# EAGLE design MRDT0002A1 (EAGLE 6.2)

## Sheet 1 of 2
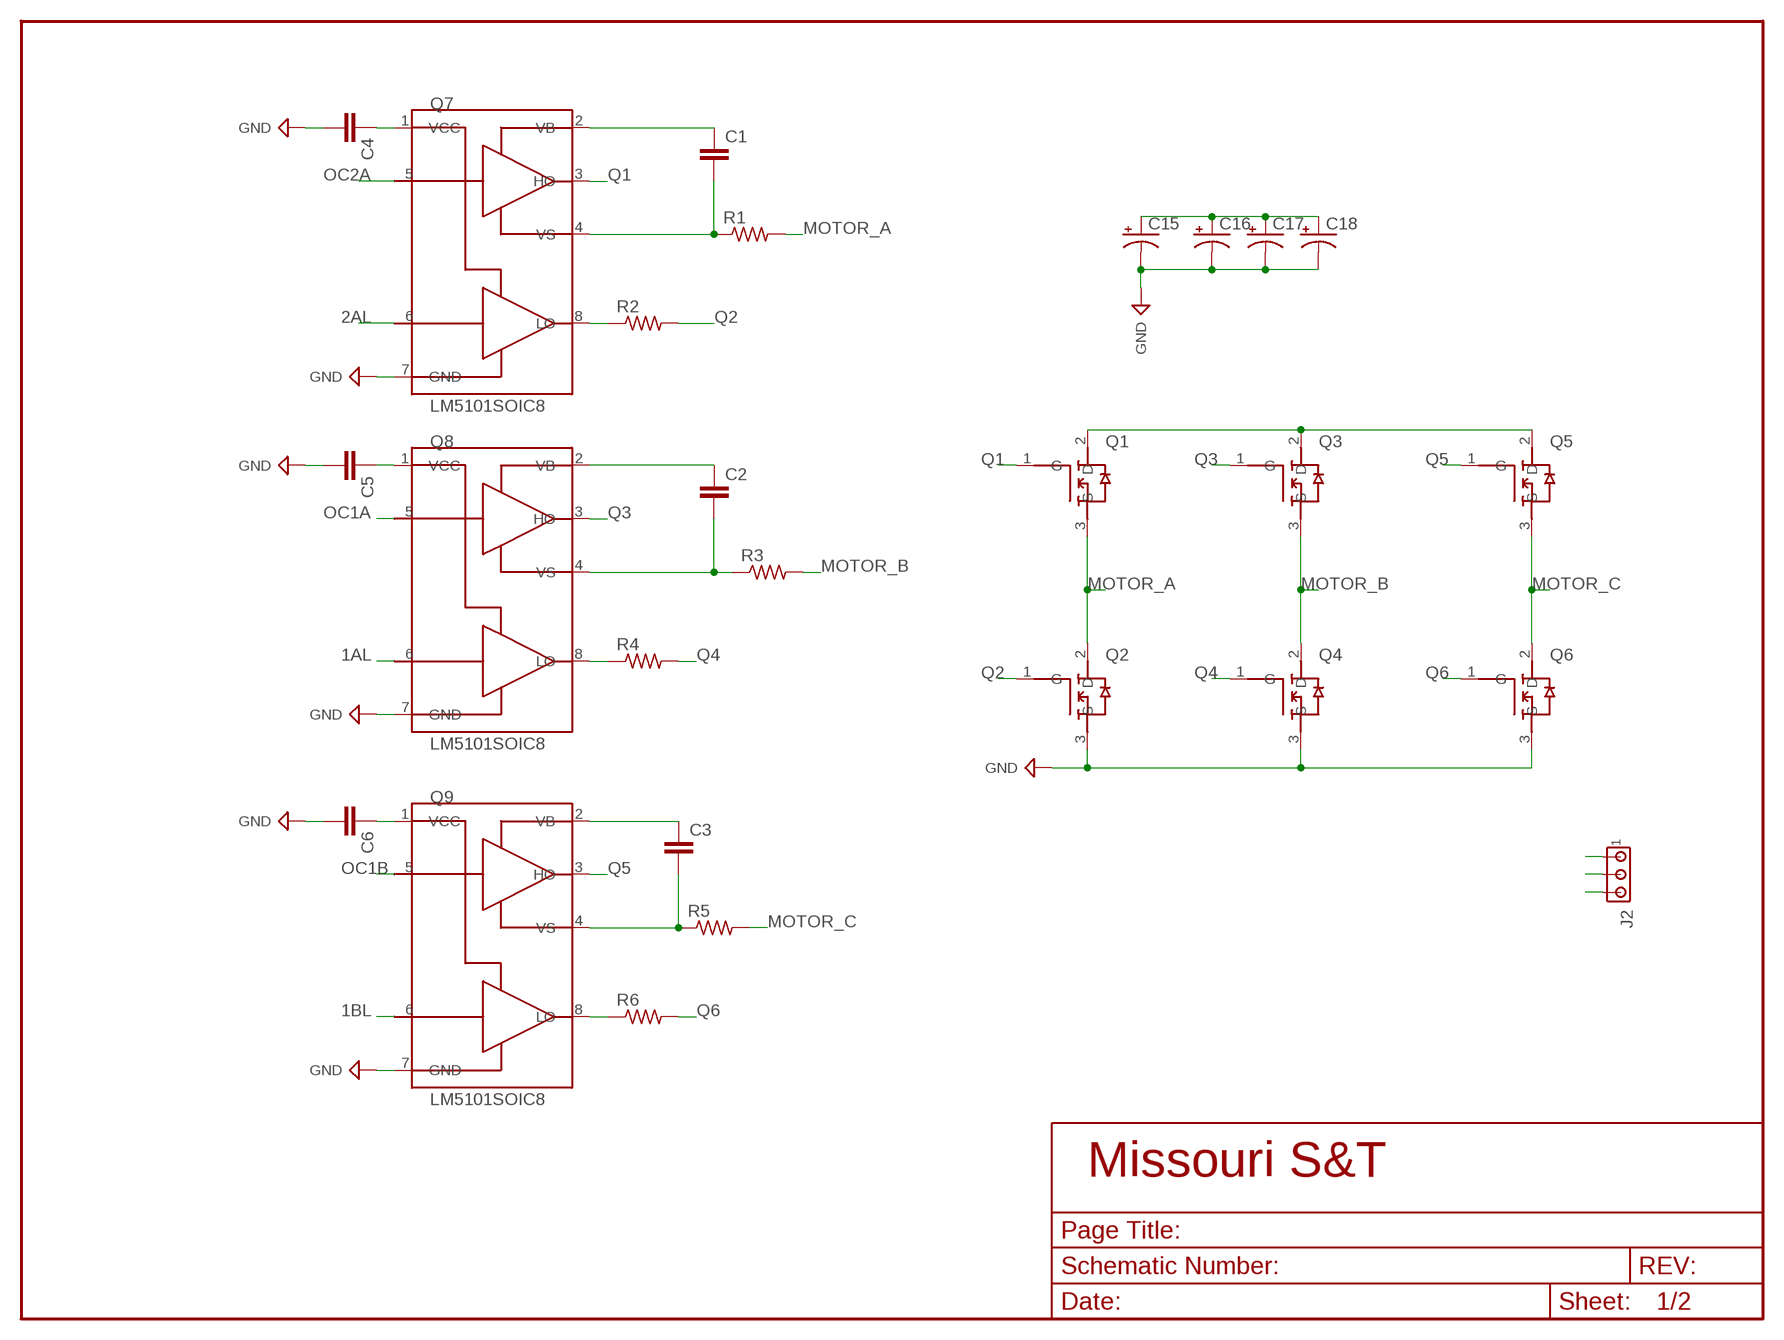
[diagram p0: schematic, sheet 1]

### Parts
C1  C_CAP_1206  [C_1206]
C2  C_CAP_1206  [C_1206]
C3  C_CAP_1206  [C_1206]
C4  C_CAP_1206  [C_1206]
C5  C_CAP_1206  [C_1206]
C6  C_CAP_1206  [C_1206]
C15  CAP_POL10MMSM  [C_10MMSM]
C16  CAP_POL10MMSM  [C_10MMSM]
C17  CAP_POL10MMSM  [C_10MMSM]
C18  CAP_POL10MMSM  [C_10MMSM]
J2  J_MTA3P_156  [J_MTA156_3P]
Q1  N-CH-MOSFETTO252  [TO-252]
Q2  N-CH-MOSFETTO252  [TO-252]
Q3  N-CH-MOSFETTO252  [TO-252]
Q4  N-CH-MOSFETTO252  [TO-252]
Q5  N-CH-MOSFETTO252  [TO-252]
Q6  N-CH-MOSFETTO252  [TO-252]
Q7  LM5101SOIC8  [SOIC8]
Q8  LM5101SOIC8  [SOIC8]
Q9  LM5101SOIC8  [SOIC8]
R1  R_RES_0805  [R_0805]
R2  R_RES_0805  [R_0805]
R3  R_RES_0805  [R_0805]
R4  R_RES_0805  [R_0805]
R5  R_RES_0805  [R_0805]
R6  R_RES_0805  [R_0805]

### Nets
1AL: Q8.6(LI) ; also sheet 2
1BL: Q9.6(LI) ; also sheet 2
2AL: Q7.6(LI) ; also sheet 2
+12V: C4.1 C5.1 C6.1 Q7.1(VCC) Q8.1(VCC) Q9.1(VCC) ; also sheet 2
+24V: C15.+ C16.+ C17.+ C18.+ Q1.2(D) Q3.2(D) Q5.2(D)
GND: C4.2 C5.2 C6.2 C15.- C16.- C17.- C18.- Q2.3(S) Q4.3(S) Q6.3(S) Q7.7(GND) Q8.7(GND) Q9.7(GND) ; supply symbol labelled SUP_GND ; also sheet 2
MOTOR_A: J2.3 Q1.3(S) Q2.2(D) R1.2
MOTOR_B: J2.2 Q3.3(S) Q4.2(D) R3.2
MOTOR_C: J2.1 Q5.3(S) Q6.2(D) R5.2
N$1: C2.1 Q8.2(VB)
N$2: C2.2 Q8.4(VS) R3.1
N$3: C3.1 Q9.2(VB)
N$4: C3.2 Q9.4(VS) R5.1
N$5: C1.1 Q7.2(VB)
N$6: C1.2 Q7.4(VS) R1.1
N$11: Q8.8(LO) R4.1
N$14: Q7.8(LO) R2.1
N$16: Q9.8(LO) R6.1
OC1A: Q8.5(HI) ; also sheet 2
OC1B: Q9.5(HI) ; also sheet 2
OC2A: Q7.5(HI) ; also sheet 2
Q1: Q1.1(G) Q7.3(HO)
Q2: Q2.1(G) R2.2
Q3: Q3.1(G) Q8.3(HO)
Q4: Q4.1(G) R4.2
Q5: Q5.1(G) Q9.3(HO)
Q6: Q6.1(G) R6.2

## Sheet 2 of 2
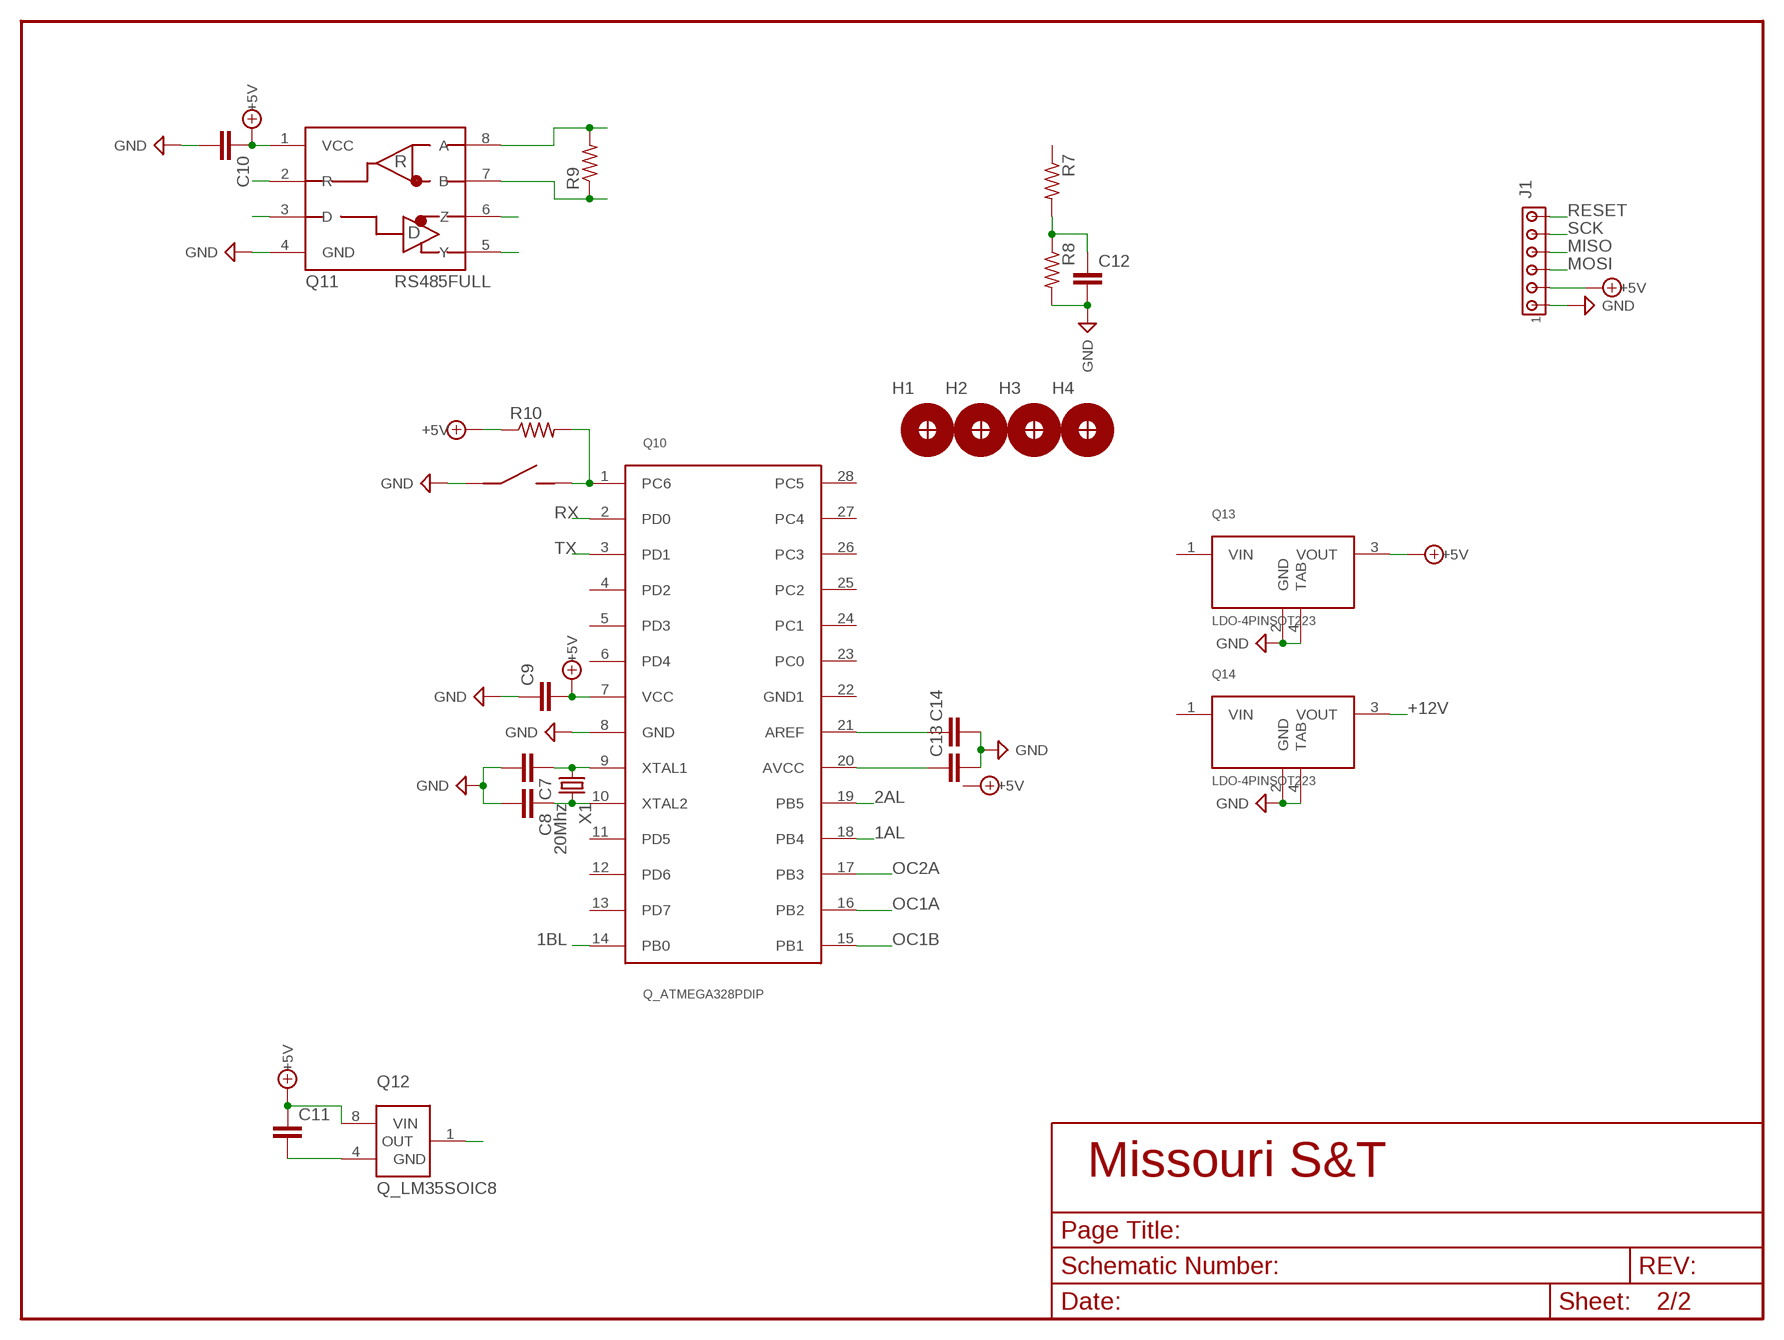
[diagram p1: schematic, sheet 2]

### Parts
C7  C_CAP_1206  [C_1206]
C8  C_CAP_1206  [C_1206]
C9  C_CAP_0805  [C_0805]
C10  C_CAP_0805  [C_0805]
C11  C_CAP_0805  [C_0805]
C12  C_CAP_0805  [C_0805]
C13  C_CAP_0805  [C_0805]
C14  C_CAP_0805  [C_0805]
H1  H_MNTHOLE_#4  [H_MNTHOLE_#4]
H2  H_MNTHOLE_#4  [H_MNTHOLE_#4]
H3  H_MNTHOLE_#4  [H_MNTHOLE_#4]
H4  H_MNTHOLE_#4  [H_MNTHOLE_#4]
J1  J_MTA6P_100  [J_MTA100_6P]
J3  J_MC32857  [J_TOGGLE]
Q10  Q_ATMEGA328PDIP  [DIP28]
Q11  RS485FULL  [SOIC8]
Q12  Q_LM35SOIC8  [SOIC8]
Q13  LDO-4PINSOT223  [SOT-223]
Q14  LDO-4PINSOT223  [SOT-223]
R7  R_RES_0805  [R_0805]
R8  R_RES_0805  [R_0805]
R9  R_RES_0805  [R_0805]
R10  R_RES_0805  [R_0805]
X1  20Mhz  X_HC49SCRYSTALTH  [HC-49]

### Nets
1AL: Q10.18(PB4) ; also sheet 1
1BL: Q10.14(PB0) ; also sheet 1
2AL: Q10.19(PB5) ; also sheet 1
+5V: C9.2 C10.1 C11.1 J1.2 Q10.7(VCC) Q11.1(VCC) Q12.8(VIN) Q13.3(VOUT) R10.1 ; supply symbol labelled SUP_+5V
+12V: Q14.3(VOUT) ; also sheet 1
GND: C7.2 C8.2 C9.1 C10.2 C12.2 C13.2 C14.2 J1.1 J3.P$1 Q10.8(GND) Q11.4(GND) Q13.2(GND) Q13.4(TAB) Q14.2(GND) Q14.4(TAB) R8.2 ; supply symbol labelled SUP_GND ; also sheet 1
MISO: J1.4
MOSI: J1.3
N$7: J3.P$2 Q10.1(PC6) R10.2
N$12: C13.1 Q10.20(AVCC)
N$15: C14.1 Q10.21(AREF)
N$17: C11.2 Q12.4(GND)
N$20: Q12.1(OUT)
N$21: C12.1 R7.2 R8.1
N$22: Q11.7(B) R9.1
N$23: Q11.8(A) R9.2
N$24: Q11.6(Z)
N$25: Q11.5(Y)
N$28: C7.1 Q10.9(XTAL1) X1.P$1
N$29: C8.1 Q10.10(XTAL2) X1.P$2
OC1A: Q10.16(PB2) ; also sheet 1
OC1B: Q10.15(PB1) ; also sheet 1
OC2A: Q10.17(PB3) ; also sheet 1
RESET: J1.6
RX: Q10.2(PD0) Q11.2(R)
SCK: J1.5
TX: Q10.3(PD1) Q11.3(D)
Unconnected: H1.1 H2.1 H3.1 H4.1 Q10.4(PD2) Q10.5(PD3) Q10.6(PD4) Q10.11(PD5) Q10.12(PD6) Q10.13(PD7) Q10.22(GND1) Q10.23(PC0) Q10.24(PC1) Q10.25(PC2) Q10.26(PC3) Q10.27(PC4) Q10.28(PC5) Q13.1(VIN) Q14.1(VIN) R7.1

## Library data of the parts
C1-C14 = Master:C_CAP
C15-C18 = Master:CAP_POL: Generic Polarized Capacitor
H1-H4 = Lib_TH:H_MNTHOLE
J1 = Lib_TH:J_MTA6P
J2 = Lib_TH:J_MTA3P
J3 = Master:J_MC32857: SWITCH, TACTILE, SPST-NO, 50mA, THD
Q1-Q6 = Master:N-CH-MOSFET: Generic N-CH MOSFET
Q7-Q9 = Master:LM5101: IC DVR HALF-BRIDGE HV 8-SOIC 120V 3A/2A/1A for A/B/C respectively
Q10 = Master:Q_ATMEGA328P: ATMEGA 328P
Q11 = Master:RS485FULL: Generic Full-Duplex RS485 Transciever, compatible with ADM485x series and MAX308x
Q12 = Master:Q_LM35: IC, TEMPERATURE SENSOR, 0.4°C, TO-92-3
Q13 Q14 = Master:LDO-4PIN: Standard 4pin LDO
R1-R9 = Master:R_RES
R10 = Lib_Passive:R_RES
X1 = Master:X_HC49SCRYSTAL: CRYSTAL METAL CAN, 16MHZ, 18PF, HC-49/US

## Board
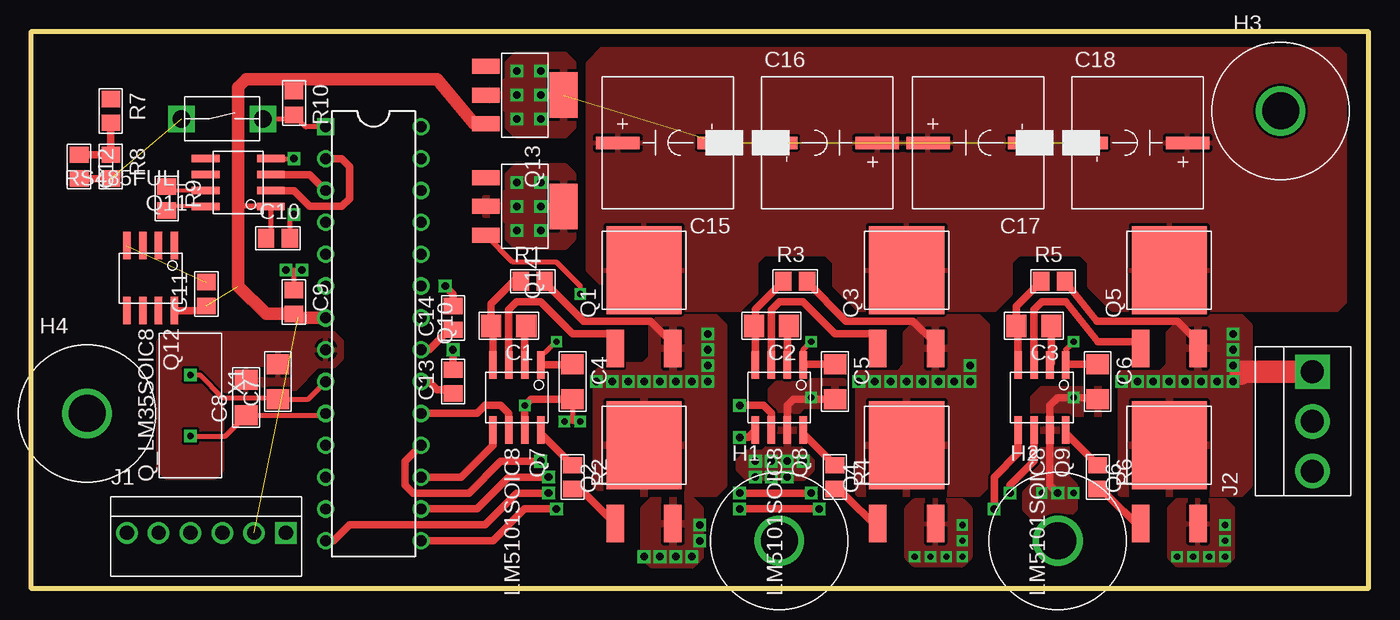
[diagram p2: board, top side]
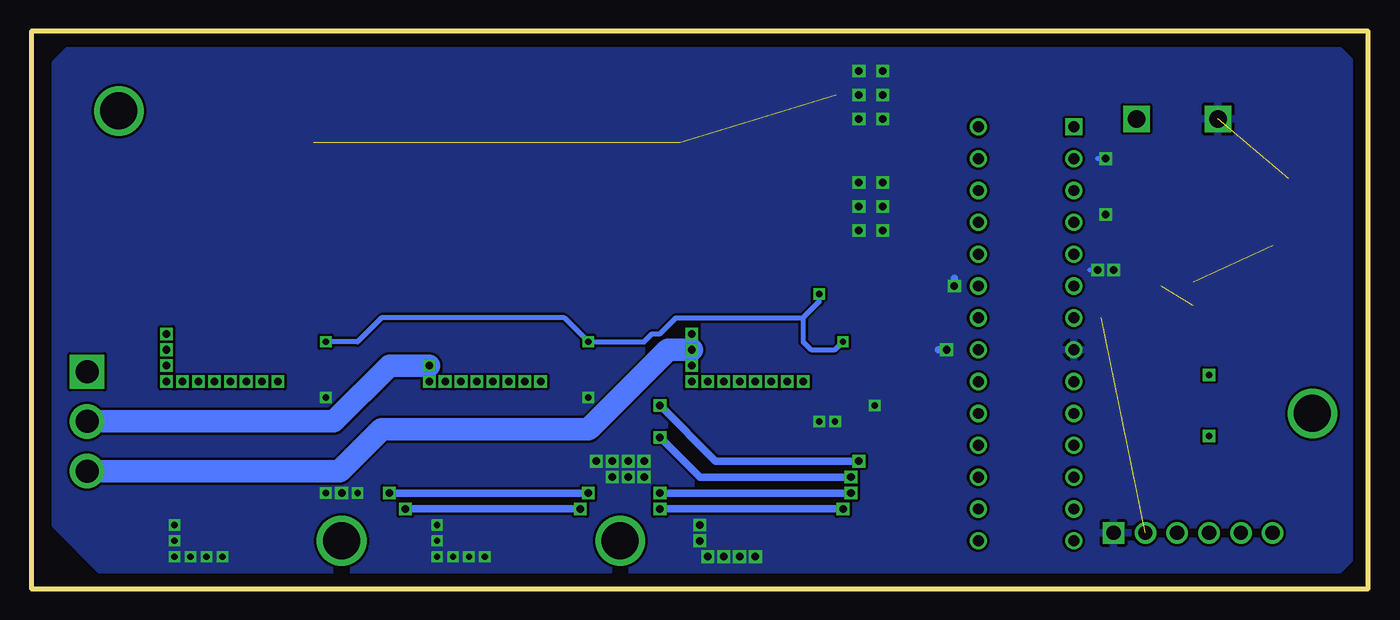
[diagram p3: board, bottom side, seen from below]

Size 106.68 x 44.45 mm. Coordinates in mm from the lower left corner, seen from the top.
Outline: 0,0 0,44.45 106.68,44.45 106.68,0 0,0
Copper layers (1*16): Top 0.035mm / dielectric 1.5mm / Bottom 0.035mm
Design rules: minimum track width 10mil, minimum drill 15mil, track to track 8mil, track to pad 8mil, pad to pad 8mil, via to via 8mil, smd to smd 8mil, copper to edge 40mil, drill to drill 8mil, minimum pad ring 10mil, minimum via ring 8mil, stop-mask expansion 4mil, vias tented up to drill 0mil, thermal gap 10mil

### Footprints (pad centres in the part's own frame; a part is rotated, then mirrored left to right if it is on the bottom)
C_1206 = smd 1.6 x 1.8: 1 -1.4,0; 2 1.4,0
C_0805 = smd 1.3 x 1.5: 1 -0.95,0; 2 0.95,0
C_10MMSM = smd 1 x 3.5: + 0,4; - 0,-4.1
H_MNTHOLE_#4 = drill 2.946: 1 0,0
J_MTA100_6P = drill 1.143 square: 1 6.35,0 | drill 1.143: 2 3.81,0; 3 1.27,0; 4 -1.27,0; 5 -3.81,0; 6 -6.35,0
J_MTA156_3P = drill 1.829 square: 1 3.962,0 | drill 1.829: 2 0,0; 3 -3.962,0
J_TOGGLE = drill 1.4 square: P$1 -3.25,0; P$2 3.25,0
TO-252 = smd 1.4 x 3: 1 -2.3,-6.25; 3 2.3,-6.25 | smd 6 x 7: 2 0,0
SOIC8 = smd 2.2 x 0.6: 1 -2.6,1.905; 2 -2.6,0.635; 3 -2.6,-0.635; 4 -2.6,-1.905; 5 2.6,-1.905; 6 2.6,-0.635; 7 2.6,0.635; 8 2.6,1.905
DIP28 = drill 0.864 square: 1 -16.51,-3.81 | drill 0.864: 2 -13.97,-3.81; 3 -11.43,-3.81; 4 -8.89,-3.81; 5 -6.35,-3.81; 6 -3.81,-3.81; 7 -1.27,-3.81; 8 1.27,-3.81; 9 3.81,-3.81; 10 6.35,-3.81; 11 8.89,-3.81; 12 11.43,-3.81; 13 13.97,-3.81; 14 16.51,-3.81; 15 16.51,3.81; 16 13.97,3.81; 17 11.43,3.81; 18 8.89,3.81; 19 6.35,3.81; 20 3.81,3.81; 21 1.27,3.81; 22 -1.27,3.81; 23 -3.81,3.81; 24 -6.35,3.81; 25 -8.89,3.81; 26 -11.43,3.81; 27 -13.97,3.81; 28 -16.51,3.81
SOT-223 = smd 1.2 x 2.2: 1 -2.3,-3.1; 2 0,-3.1; 3 2.3,-3.1 | smd 3.6 x 2.2: 4 0,3.1
R_0805 = smd 1.3 x 1.5: 1 -0.95,0; 2 0.95,0
HC-49 = drill 0.5 square: P$1 -2.44,0; P$2 2.44,0

### Placement (x,y rotation side)
C1  38.1,20.95 180 top
C2  59.05,20.95 180 top
C3  80.01,20.95 180 top
C4  43.18,16.51 270 top
C5  64.14,16.51 270 top
C6  85.09,16.51 270 top
C7  19.68,16.51 90 top
C8  17.14,15.24 90 top
C9  20.95,22.86 270 top
C10  19.68,27.94 0 top
C11  13.97,23.5 90 top
C12  3.81,33.66 270 top
C13  33.66,16.51 90 top
C14  33.66,21.59 90 top
C15  50.8,35.56 90 top
C16  63.5,35.56 270 top
C17  75.56,35.56 90 top
C18  88.27,35.56 270 top
H1  59.69,3.81 0 top
H2  81.92,3.81 0 top
H3  99.69,38.1 0 top
H4  4.45,13.97 0 top
J1  13.97,4.45 0 top
J2  102.23,13.34 90 top
J3  15.24,37.47 0 top
Q1  48.9,25.4 0 top
Q2  48.9,11.43 0 top
Q3  69.85,25.4 0 top
Q4  69.85,11.43 0 top
Q5  90.81,25.4 0 top
Q6  90.81,11.43 0 top
Q7  38.73,15.24 270 top
Q8  59.69,15.24 270 top
Q9  80.64,15.24 270 top
Q10  27.3,20.32 270 top
Q11  16.51,32.38 180 top
Q12  9.53,24.77 270 top
Q13  39.37,39.37 270 top
Q14  39.37,30.48 270 top
R1  40.01,24.51 0 top
R2  43.18,8.89 270 top
R3  60.96,24.51 0 top
R4  64.14,8.89 270 top
R5  81.53,24.51 0 top
R6  85.09,8.89 270 top
R7  6.35,38.1 270 top
R8  6.35,33.66 270 top
R9  10.79,31.11 270 top
R10  20.95,38.73 270 top
X1  12.7,14.61 270 top

### Tracks (layer width: path | path; a pad name or v marks a point on that pad's centre or on a via)
1AL  (via drill 0.6)
  Top 0.61: Q10.18 29.84,10.16 29.84,8.26 30.48,7.62 34.92,7.62 37.47,10.16 v40.64,10.16 | v56.52,14.61 58.42,14.61 59.05,13.97 Q8.6
  Bottom 0.61: v40.64,10.16 52.07,10.16 v56.52,14.61
1BL  (via drill 0.6)
  Top 0.61: Q10.14 24.13,3.81 25.4,5.08 36.2,5.08 38.73,7.62 v41.27,7.62 | v56.52,7.62 v62.23,7.62 | v78.11,7.62 78.11,8.26 80.01,10.16 Q9.6
  Bottom 0.61: v41.27,7.62 v56.52,7.62 | v62.23,7.62 v78.11,7.62
2AL
  Top 0.61: Q7.6 38.1,13.97 37.47,14.61 36.2,14.61 35.56,13.97 Q10.19
+5V  (2 unrouted)
  Top 0.406: C10.1 19.11,28.32 Q11.1 16.51,30.48 | R10.1 20.95,40.64
  Top 0.61: Q12.8 13.59,22.16 C11.1
  Top 1.016: Q13.3 35.32,37.07 32.38,40.64 20.95,40.64 17.14,40.64 16.51,40.01 16.51,30.48 16.51,24.13 18.73,21.91 C9.2 21.27,21.59 Q10.7
+12V  (via drill 0.5)
  Top 0.406: v83.19,19.68 82.55,19.05 Q9.1 | Q8.1 61.59,19.05 v62.23,19.68 | v41.91,19.68 40.64,18.48 Q7.1 | v43.81,23.5 43.81,24.13 41.91,26.04 38.41,26.04 Q14.3
  Top 0.61: Q7.1 43.11,17.84 C4.1 | C5.1 61.66,17.91 Q8.1 | C6.1 82.62,17.91 Q9.1
  Bottom 0.406: v83.19,19.68 80.64,19.68 78.74,21.59 64.14,21.59 v62.23,19.68 57.78,19.68 57.15,20.32 56.52,20.32 55.24,21.59 45.09,21.59 | 45.09,21.59 45.09,19.68 44.45,19.05 42.55,19.05 v41.91,19.68 | v43.81,23.5 43.81,22.86 45.09,21.59
+24V
  pour Top: 47.62,22.23 44.45,25.4 44.45,41.91 45.72,43.18 104.14,43.18 104.78,42.55 104.78,22.86 104.14,22.23 86.36,22.23 84.45,24.13 84.45,26.04 83.82,26.67 78.74,26.67 78.11,26.04 78.11,23.5 76.83,22.23 66.04,22.23 64.14,24.13 64.14,26.04 63.5,26.67 58.42,26.67 57.78,26.04 57.78,23.5 56.52,22.23
GND  (via drill 0.5, 0.6)  (5 unrouted)
  Top 0.406: 20.95,28.26 C10.2 20.64,29.52 v20.95,29.84 | C4.2 43.18,13.34 | 43.18,13.34 v43.81,13.34 | 43.18,13.34 v42.55,13.34 | Q11.4 v20.95,34.29 | C9.1 20.95,25.4 | 20.95,25.4 v20.32,25.4 | 20.95,25.4 v21.59,25.4
  Top 0.61: 81.28,13.34 Q9.7 | Q9.7 81.28,14.61 81.92,15.24 v83.19,15.24 84.96,15.24 C6.2 | C5.2 60.83,15.11 60.33,14.61 Q8.7 | C4.2 39.88,15.11 v39.37,14.61 Q7.7 | C12.2 R8.2 | Q9.7 81.28,8.26 v81.92,7.62 | C13.2 v33.66,19.05 | C14.2 33.66,23.5 v33.02,24.13
  Bottom 0.406: v20.95,34.29 21.59,34.29 | v21.59,25.4 22.23,25.4
  Bottom 0.61: v33.66,19.05 34.29,19.05 | v33.02,24.13 33.02,24.77
  other vias: 57.78,10.16 59.05,10.16 60.33,10.16 61.59,10.16 48.9,2.54 50.16,2.54 51.44,2.54 52.7,2.54 53.34,3.81 53.34,5.08 57.78,8.89 59.05,8.89 60.33,8.89 62.23,15.24 80.64,7.62 83.19,7.62 70.48,2.54 71.75,2.54 73.03,2.54 74.3,2.54 74.3,3.81 74.3,5.08 91.44,2.54 92.71,2.54 93.98,2.54 95.25,2.54 95.25,3.81 95.25,5.08 38.73,32.38 40.64,32.38 38.73,30.48 40.64,30.48 38.73,28.57 40.64,28.57 38.73,41.27 40.64,41.27 38.73,39.37 40.64,39.37 38.73,37.47 40.64,37.47
  pour Top: 22.86,17.78 24.13,17.78 24.77,18.41 24.77,19.68 24.13,20.32 10.79,20.32 10.16,19.68 10.16,9.53 10.79,8.89 14.61,8.89 15.24,9.53 15.24,15.24 15.88,15.88 20.95,15.88
  pour Bottom: 100.97,1.27 104.78,5.08 104.78,41.91 103.5,43.18 2.54,43.18 1.27,41.91 1.27,2.54 2.54,1.27
  pour Top: 64.77,16.51 59.69,16.51 59.05,15.88 59.05,11.43 58.42,10.79 57.15,10.79 56.52,10.16 56.52,9.53 57.15,8.89 61.59,8.89 62.23,9.53 62.23,10.16 60.96,11.43 60.96,13.97 61.59,14.61 64.77,14.61
  pour Top: 52.7,6.99 49.53,6.99 48.9,6.35 48.9,2.54 49.53,1.91 52.7,1.91 53.34,2.54 53.34,6.35
  pour Top: 85.72,15.88 80.64,15.88 80.01,15.24 80.01,8.26 79.38,7.62 79.38,6.35 80.01,5.71 82.55,5.71 83.19,6.35 83.19,8.26 82.55,8.89 82.55,13.34 83.19,13.97 85.72,13.97
  pour Top: 74.3,6.99 70.48,6.99 69.85,6.35 69.85,2.54 70.48,1.91 74.3,1.91 74.93,2.54 74.93,6.35
  pour Top: 95.25,6.99 91.44,6.99 90.81,6.35 90.81,2.54 91.44,1.91 95.25,1.91 95.89,2.54 95.89,6.35
  pour Top: 36.2,31.11 37.47,31.11 38.1,31.75 38.1,33.02 38.73,33.66 42.55,33.66 43.18,33.02 43.18,27.94 42.55,27.3 38.73,27.3 38.1,27.94 38.1,29.21 37.47,29.84 36.2,29.84
  pour Top: 36.83,40.01 37.47,40.01 38.1,40.64 38.1,41.91 38.73,42.55 42.55,42.55 43.18,41.91 43.18,36.83 42.55,36.2 38.73,36.2 38.1,36.83 38.1,38.1 37.47,38.73 36.83,38.73
MOTOR_A  (via drill 0.6)
  Top 0.61: R1.2 40.95,24.45 44.07,21.34 49.4,21.34 51.18,19.56 51.18,19.16 Q1.3 51.08,19.15
  Bottom 1.778: J2.3 82.07,9.37 78.74,12.7 62.23,12.7 55.88,19.05 v53.98,19.05
  other vias: 46.35,16.51 47.62,16.51 48.9,16.51 50.16,16.51 51.44,16.51 52.7,16.51 53.98,20.32 53.98,17.78 53.98,16.51 45.09,16.51
  pour Top: 55.24,8.26 55.24,20.95 54.61,21.59 50.16,21.59 49.53,20.95 49.53,18.41 48.9,17.78 45.72,17.78 45.09,17.14 45.09,8.26 45.72,7.62 54.61,7.62
MOTOR_B  (via drill 0.6)
  Top 0.61: R3.2 61.85,24.51 65.02,21.34 70.36,21.34 72.14,19.56 72.39,19.56 72.39,19.39 Q3.3
  Bottom 1.778: J2.2 82.55,13.34 78.11,17.78 v74.93,17.78
  other vias: 66.04,16.51 67.31,16.51 68.58,16.51 69.85,16.51 71.12,16.51 72.39,16.51 73.66,16.51 74.93,16.51
  pour Top: 75.56,21.59 71.12,21.59 69.85,20.32 69.85,17.78 69.22,17.14 66.04,17.14 66.04,7.62 75.56,7.62 76.2,8.26 76.2,20.95
MOTOR_C  (via drill 0.6)
  Top 0.61: 93.11,19.29 Q5.3 93.09,19.16 93.09,19.68 91.44,21.34 85.02,21.34 R5.2
  Top 1.778: J2.1 96.67,17.3 96.52,17.14
  other vias: 87,16.51 88.27,16.51 89.53,16.51 90.81,16.51 92.08,16.51 93.34,16.51 94.61,16.51 95.89,20.32 95.89,19.05 95.89,17.78 95.89,16.51
  pour Top: 97.16,8.26 97.16,20.95 96.52,21.59 92.08,21.59 90.81,20.32 90.81,17.78 90.17,17.14 87,17.14 87,7.62 96.52,7.62
N$1
  Top 0.61: Q8.2 60.33,20.82 C2.1
N$2
  Top 0.61: Q8.4 57.78,20.82 C2.2 57.78,21.09 57.78,22.29 R3.1
N$3
  Top 0.61: C3.1 81.41,17.97 Q9.2
N$4
  Top 0.61: Q9.4 78.74,20.82 C3.2 78.61,22.54 R5.1
N$5
  Top 0.61: Q7.2 39.37,20.82 C1.1
N$6
  Top 0.61: Q7.4 36.83,20.82 C1.2 36.7,22.73 38.73,24.77 R1.1
N$7
  Top 0.406: J3.P$2 20.64,37.47 R10.2 21.91,36.83 Q10.1
N$11
  Top 0.61: Q8.8 61.59,12.38 R4.1
N$12
  Top 0.61: Q10.20 31.75,16.51 32.38,15.88 33.34,15.88 C13.1
N$14
  Top 0.61: Q7.8 40.64,12.38 R2.1
N$15
  Top 0.61: Q10.21 31.75,19.05 33.02,20.32 33.34,20.32 C14.1
N$16
  Top 0.61: Q9.8 82.55,12.38 R6.1
N$17  (1 unrouted)
N$21
  Top 0.61: R7.2 R8.1 C12.1
N$22
  Top 0.305: Q11.7 11.11,31.75 R9.1
N$23
  Top 0.305: Q11.8 10.47,30.48 R9.2
N$28
  Top 0.406: X1.P$1 13.44,17.05 15.24,15.24 19.55,15.24 C7.1 22.09,15.11 Q10.9
N$29
  Top 0.406: X1.P$2 15.47,12.16 C8.1 23.36,13.84 Q10.10
OC1A  (via drill 0.6)
  Top 0.61: Q10.16 35.56,6.35 38.1,8.89 v41.27,8.89 | v56.52,12.06 57.21,12.06 Q8.5
  Bottom 0.61: v41.27,8.89 53.34,8.89 v56.52,12.06
OC1B  (via drill 0.6)
  Top 0.61: Q10.15 36.83,3.81 39.37,6.35 v41.91,6.35 | v62.87,6.35 v56.52,6.35 | v76.83,6.35 76.83,8.89 78.74,10.79 Q9.5
  Bottom 0.61: v76.83,6.35 v62.87,6.35 | v56.52,6.35 v41.91,6.35
OC2A
  Top 0.61: Q10.17 34.29,8.89 36.83,11.43 Q7.5
Q1
  Top 0.61: Q7.3 38.1,22.23 38.73,22.86 40.64,22.86 43.18,20.32 46.35,20.32 46.99,19.68 | 46.99,20.32 46.99,19.68 | 46.99,19.68 46.99,19.55 Q1.1
Q2
  Top 0.61: R2.2 43.84,7.94 Q2.1
Q3
  Top 0.61: Q8.3 59.05,22.23 59.69,22.86 61.59,22.86 64.14,20.32 67.31,20.32 67.31,19.39 Q3.1
Q4
  Top 0.61: R4.2 64.45,7.94 67.94,4.45 67.94,4.79 Q4.1
Q5
  Top 0.61: Q9.3 80.01,22.23 80.64,22.86 82.55,22.86 85.09,19.68 87.97,19.68 Q5.1
Q6
  Top 0.61: R6.2 85.41,7.94 88.9,4.45 88.9,4.79 Q6.1
RX
  Top 0.61: Q11.2 20.95,31.75 22.23,30.48 24.77,30.48 25.4,31.11 25.4,33.66 24.77,34.29 Q10.2
TX
  Top 0.61: Q11.3 22.23,33.02 Q10.3